# EAGLE design Front Node_KKmolex (EAGLE 7.4.0)
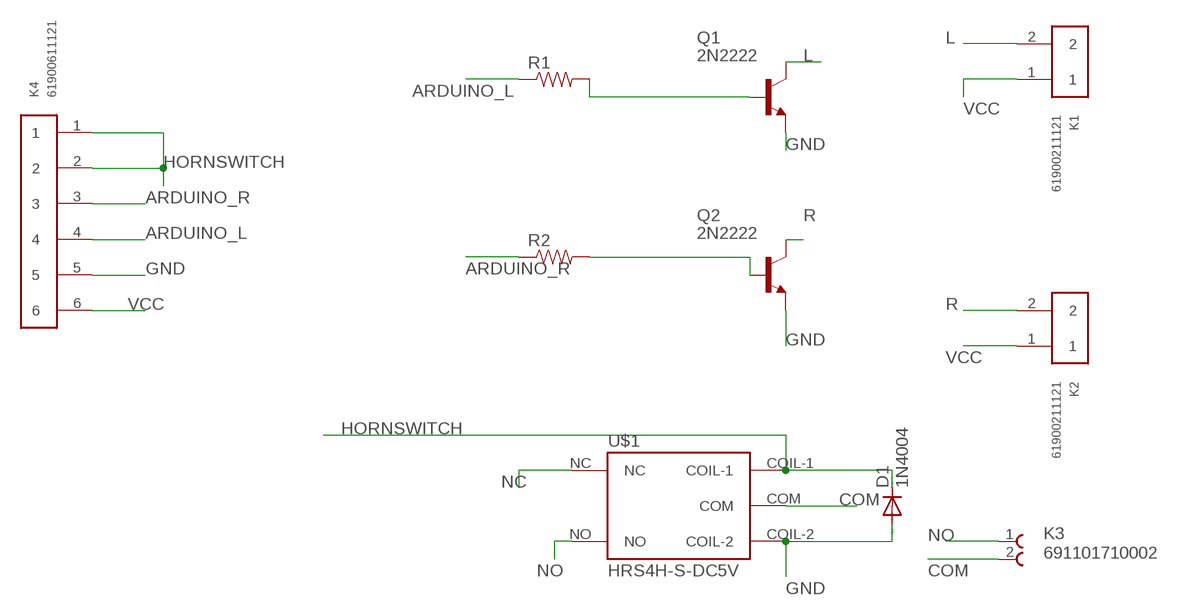
[diagram p0: schematic, sheet 1]

## Parts
D1  1N4004  [DO41-10]
K1  61900211121  [61900211121]
K2  61900211121  [61900211121]
K3  691101710002  [691101710002]
K4  61900611121  [61900611121]
Q1  2N2222  [TO18]
Q2  2N2222  [TO18]
R1  RESISTORPTH-1/4W  [AXIAL-0.4]
R2  RESISTORPTH-1/4W  [AXIAL-0.4]
U$1  HRS4H-S-DC5V  [RELAY]

## Nets
ARDUINO_L: K4.4 R1.P$1
ARDUINO_R: K4.3 R2.P$1
COM: K3.2 U$1.COM
GND: D1.A K4.5 Q1.1(E) Q2.1(E) U$1.COIL-2
HORNSWITCH: D1.C K4.1 K4.2 U$1.COIL-1
L: K1.2 Q1.3(C)
N$5: Q2.2(B) R2.P$2
N$8: Q1.2(B) R1.P$2
NC: U$1.NC
NO: K3.1 U$1.NO
R: K2.2 Q2.3(C)
VCC: K1.1 K2.1 K4.6

## Library data of the parts
D1 = diode:1N4004: DIODE general purpose rectifier, 1 A
K1 K2 = Wurth_Elektronik_Electromechanic_Wire_to_Board_Connectors_rev15c:61900211121: WR-WTB 2.54mm Male Locking Header, 2 Pins=>Code : Con_WTB_2.54_PCB_THT_61900211121 <http://katalog.we-online.de/media/thumbs2/eican/thb_Con_WTB_2.54_PCB_THT_6190xx11121_pf2.jpg> Details see: http://katalog.we-online.de/en/em/619_0xx_111_21 Created 2014-06-05, Karrer Zheng 2014 (C) Würth Elektronik
K3 = Wurth_Elektronik_Electromechanic_Terminal_Blocks_Connectors_rev15d:691101710002: WR-TBL Serie 101 - 5.0mm HOrizontal Entry Modular with Pressure Clamp - 2.5mm2 Wires , 2 pins=>Code : Con-TBL_Screw_PressureClamp_691101710002 <http://katalog.we-online.de/media/images/eican/Con-TBL_Screw_PressureClamp_6911017100xx_pf2.jpg> Details see: http://katalog.we-online.de/en/em/691_101_710_0xx Created 2014-06-16, Karrer Zheng 2014 (C) Würth Elektronik
K4 = Wurth_Elektronik_Electromechanic_Wire_to_Board_Connectors_rev15c:61900611121: WR-WTB 2.54mm Male Locking Header, 6 Pins=>Code : Con_WTB_2.54_PCB_THT_61900611121 <http://katalog.we-online.de/media/thumbs2/eican/thb_Con_WTB_2.54_PCB_THT_6190xx11121_pf2.jpg> Details see: http://katalog.we-online.de/en/em/619_0xx_111_21 Created 2014-06-05, Karrer Zheng 2014 (C) Würth Elektronik
Q1 Q2 = transistor-npn:2N2222*: NPN Transistor
R1 R2 = SparkFun-Passives:RESISTOR: Resistor Basic schematic elements and footprints for 0603, 1206, and PTH resistors.
U$1 = Hooman:HRS4H-S-DC5V

## Board
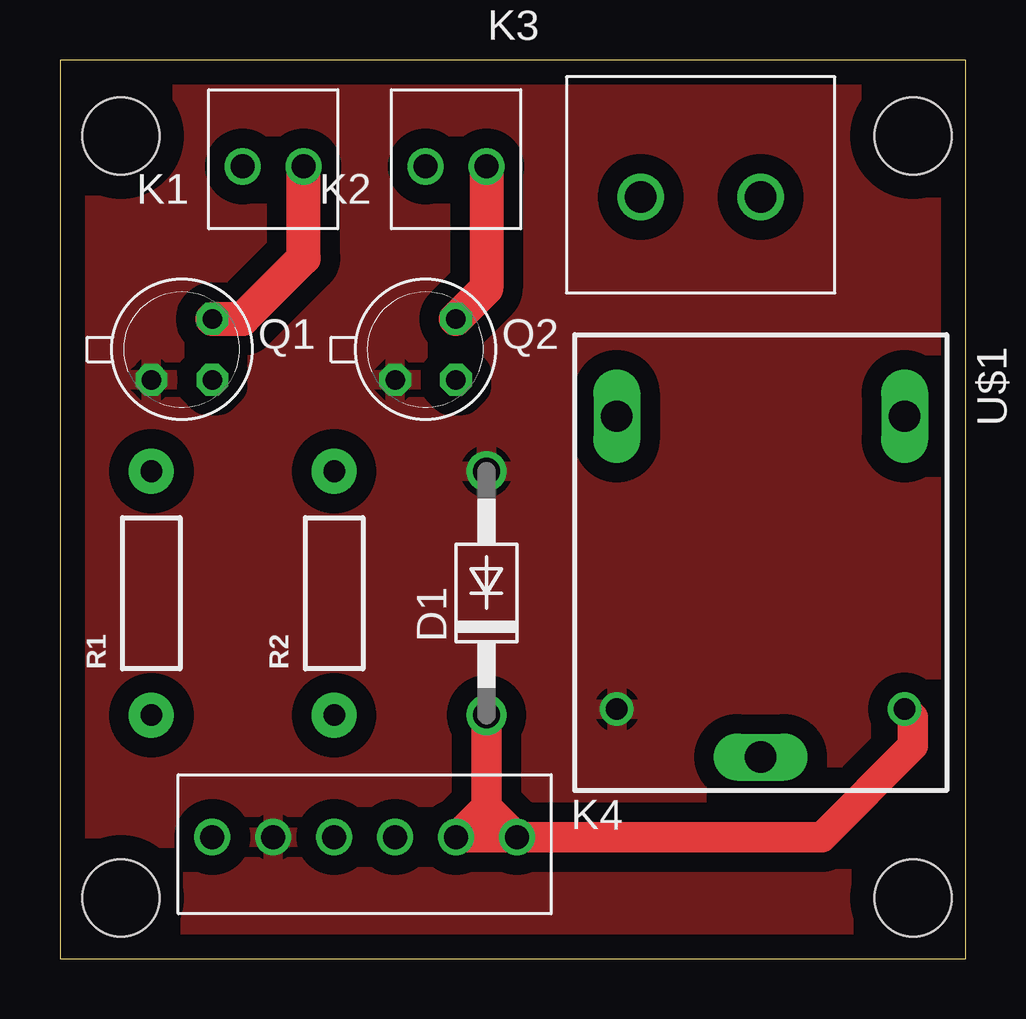
[diagram p1: board, top side]
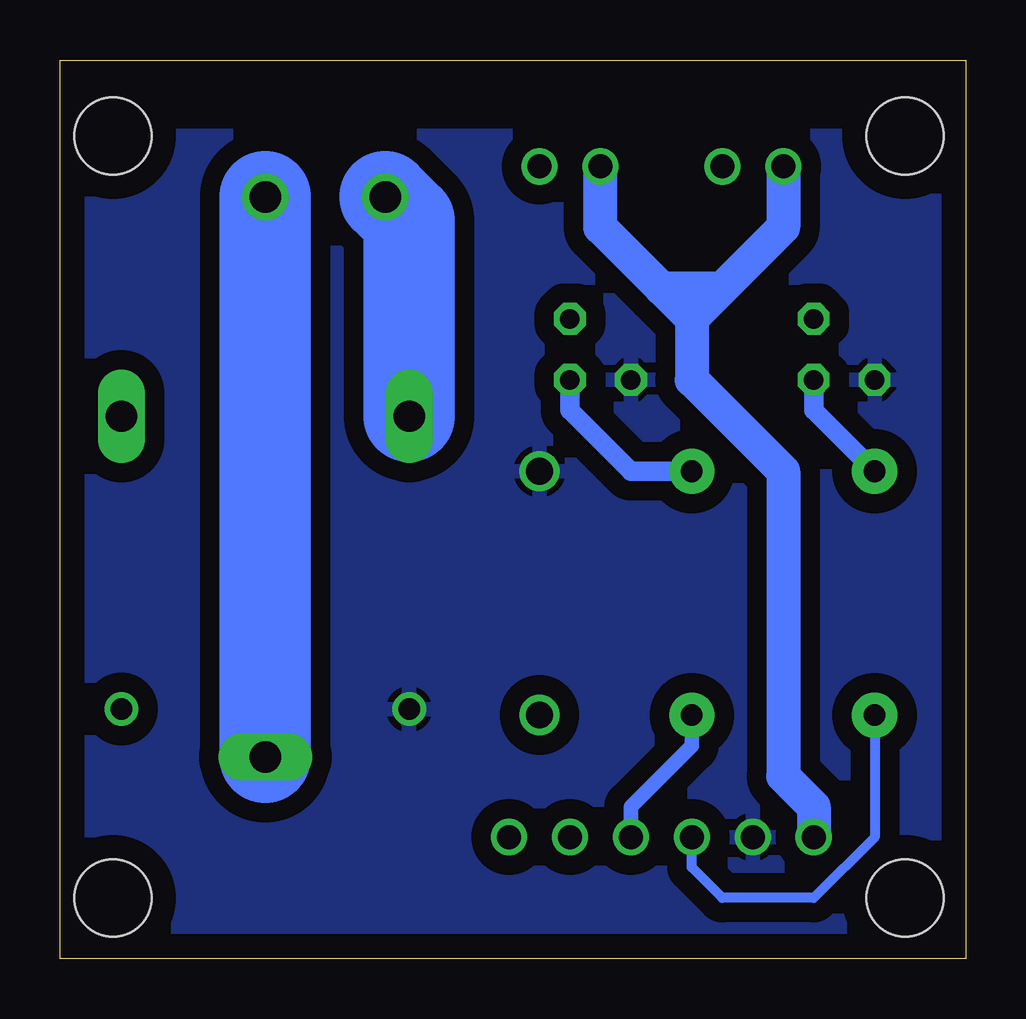
[diagram p2: board, bottom side, seen from below]

Size 37.77 x 37.45 mm. Coordinates in mm from the lower left corner, seen from the top.
Outline: 0,0 37.77,0 37.77,37.45 0,37.45 0,0
Copper layers (1*16): Top 0.035mm / dielectric 1.5mm / Bottom 0.035mm
Design rules "default": minimum track width 10mil, minimum drill 24mil, track to track 8mil, track to pad 8mil, pad to pad 8mil, via to via 8mil, smd to smd 8mil, copper to edge 40mil, drill to drill 8mil, minimum pad ring 10mil, minimum via ring 8mil, stop-mask expansion 4mil, vias tented up to drill 0mil, thermal gap 10mil
Holes 3.2 mm at 2.54,34.29 2.54,2.54 35.56,2.54 35.56,34.29
tKeepout: area -1.3,-1.3 to 0,38.1; area 0,-1.3 to 39.4,0; area 37.8,0 to 39.1,38.4; area -1.3,37.3 to 37.8,38.1

### Footprints (pad centres in the part's own frame; a part is rotated, then mirrored left to right if it is on the bottom)
DO41-10 = drill 1.118: A 5.08,0; C -5.08,0
61900211121 = drill 1: 1 1.27,0; 2 -1.27,0
691101710002 = drill 1.3: 1 -5,0; 2 0,0
61900611121 = drill 1: 1 1.27,0; 2 -1.27,0; 3 -3.81,0; 4 -6.35,0; 5 -8.89,0; 6 -11.43,0
TO18 = drill 0.813 octagon: 1 -1.27,-1.27; 2 1.27,-1.27; 3 1.27,1.27
AXIAL-0.4 = drill 0.9 pad 1.88: P$1 -5.08,0; P$2 5.08,0
RELAY = drill 0.9: COIL-1 6.1,6; COIL-2 6.1,-6 | drill 1.3 long: COM 8.1,0; NC -6.1,6; NO -6.1,-6

### Placement (x,y rotation side)
D1  17.78,15.24 90 top
K1  8.89,33.02 180 top
K2  16.51,33.02 180 top
K3  29.21,31.75 0 top
K4  17.78,5.08 0 top
Q1  5.08,25.4 0 top
Q2  15.24,25.4 0 top
R1  3.81,15.24 90 top
R2  11.43,15.24 90 top
U$1  29.21,16.51 270 top

### Tracks (layer width: path | path; a pad name or v marks a point on that pad's centre or on a via)
ARDUINO_L
  Bottom 0.406: R1.P$1 3.81,5.08 6.35,2.54 10.16,2.54 11.43,3.81 K4.4
ARDUINO_R
  Bottom 0.61: R2.P$1 11.43,8.89 13.97,6.35 K4.3
COM
  Bottom 3.81: U$1.COM K3.2
GND
  pour Top (isolate 0.813): 0,36.83 38.1,36.83 38.1,0 0,0
  pour Bottom (isolate 0.813): 0,34.29 36.83,34.29 38.1,36.83 38.1,0 0,0
HORNSWITCH
  Top 1.27: K4.1 31.75,5.08 35.56,8.89 35.56,10.06 U$1.COIL-1 | D1.C 17.78,6.35 | 17.78,6.35 K4.1 | 17.78,6.35 K4.2 K4.1
L
  Top 1.422: Q1.3 7.62,26.67 10.16,29.21 K1.2
N$5
  Bottom 0.813: Q2.2 16.51,22.86 13.97,20.32 R2.P$2
N$8
  Bottom 0.813: R1.P$2 6.35,22.86 Q1.2
NO
  Bottom 3.81: U$1.NO 23.21,30.75 K3.1
R
  Top 1.422: K2.2 17.78,27.94 Q2.3
VCC
  Bottom 1.422: K1.1 7.62,30.48 10.16,27.94 | 12.7,27.94 10.16,27.94 | 12.7,27.94 15.24,30.48 K2.1 | 10.16,27.94 11.43,26.67 | 11.43,26.67 12.7,27.94 | 11.43,26.67 11.43,24.13 7.62,20.32 7.62,7.62 6.35,6.35 K4.6